# EAGLE board eTapper1main34 (EAGLE 8.3.2)
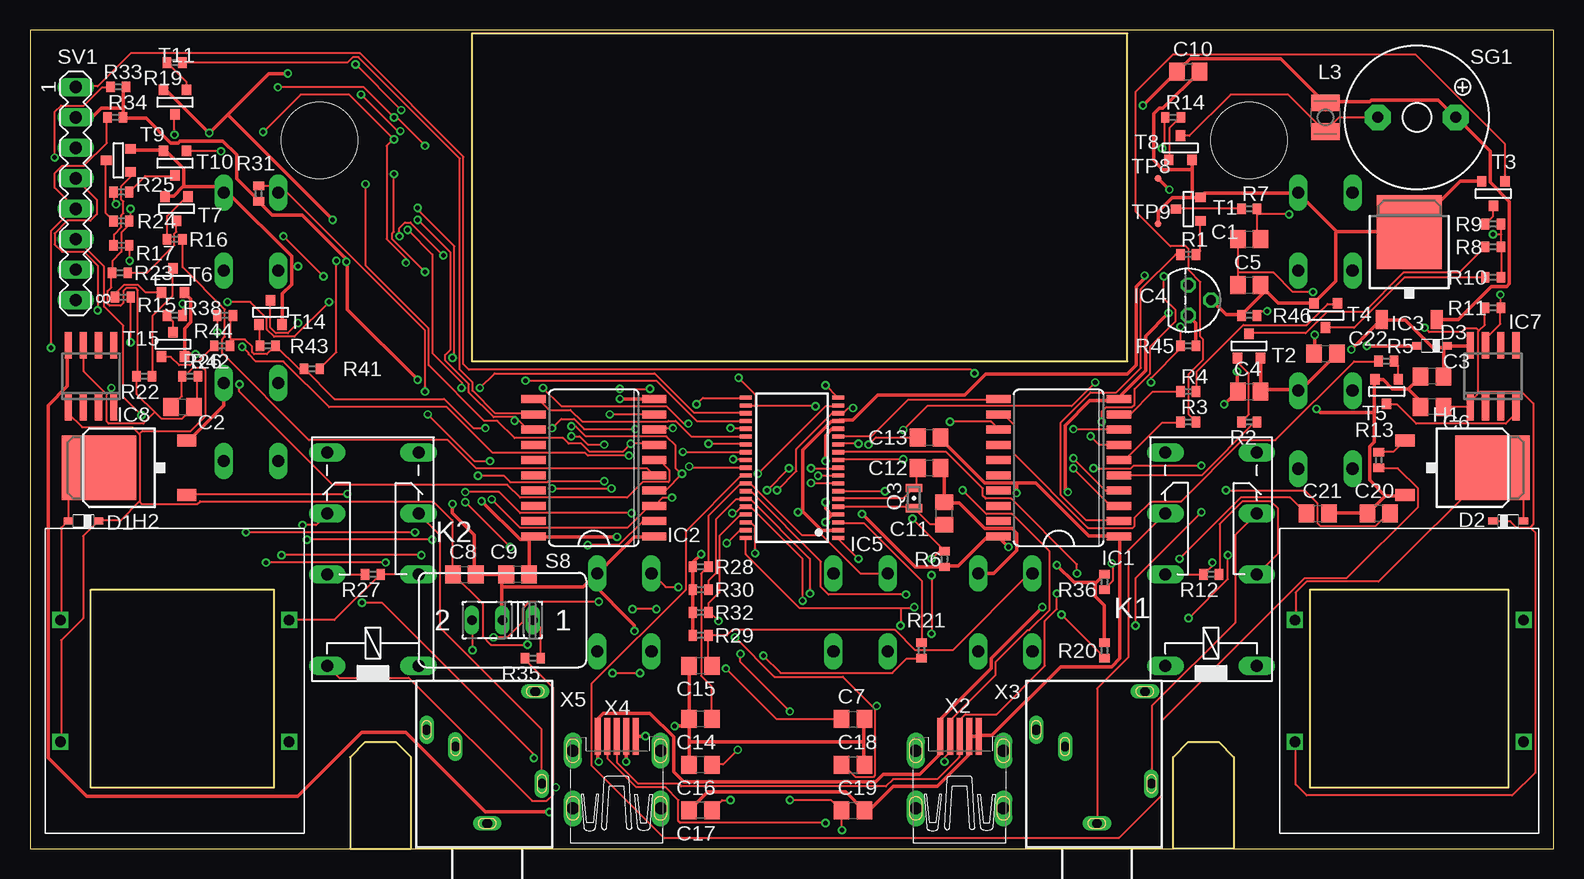
[diagram p1: board, top side]
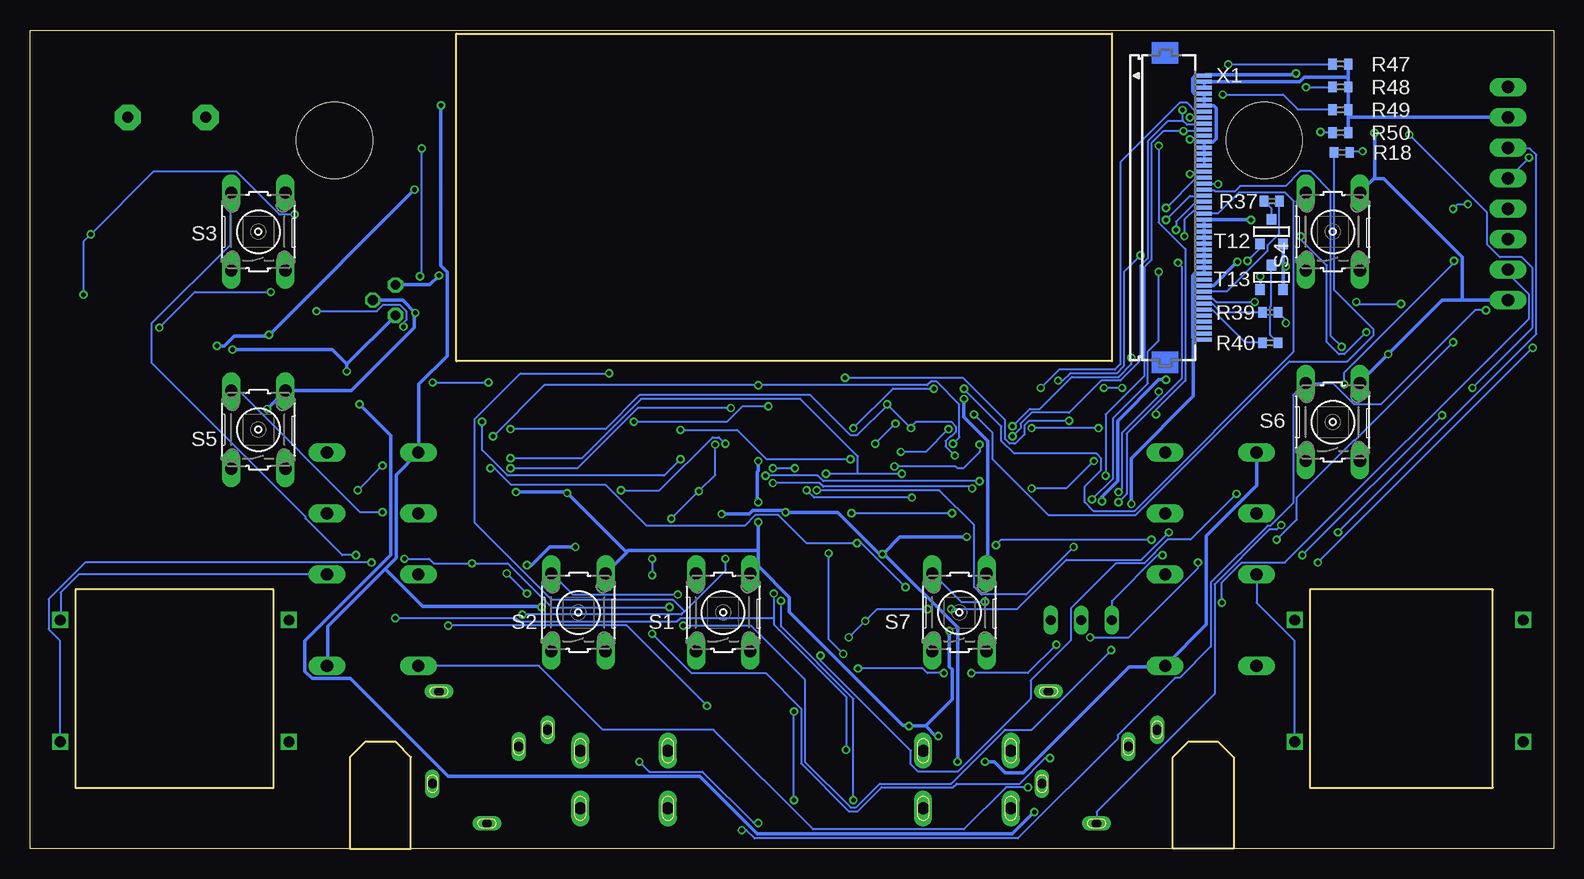
[diagram p2: board, bottom side, seen from below]

Size 126.98 x 68.25 mm. Coordinates in mm from the lower left corner, seen from the top.
Outline: 26.67,0 0,0 0,68.25 126.98,68.25 126.98,0 100.33,0
Outline: 31.75,0 95.25,0
Outline: 26.67,0 26.67,7.62 27.94,8.89 30.48,8.89 31.75,7.62 31.75,0
Outline: 26.67,0 31.75,0
Outline: 95.25,0 95.25,7.62 96.52,8.89 99.06,8.89 100.33,7.62 100.33,0
Outline: 100.33,0 95.25,0
Outline: 106.68,21.59 123.19,21.59 123.19,5.08 106.68,5.08 106.68,21.59
Outline: 5.08,21.59 20.32,21.59 20.32,5.08 5.08,5.08 5.08,21.59
Outline: 36.83,67.94 36.83,40.64 91.44,40.64 91.44,67.94 36.83,67.94
Copper layers (1*16): Top 0.035mm / dielectric 1.5mm / Bottom 0.035mm
Design rules "default *": minimum track width 6mil, minimum drill 15mil, track to track 6mil, track to pad 6mil, pad to pad 6mil, via to via 6mil, smd to smd 6mil, copper to edge 20mil, drill to drill 6mil, minimum pad ring 6mil, minimum via ring 6mil, stop-mask expansion 4mil, vias tented up to drill 0mil, thermal gap 10mil
Net classes: 1 GND: width 0.305 mm, clearance 0.152 mm; 2 BAT+: width 0.305 mm, clearance 0.152 mm; 3 +9V: width 0.305 mm, clearance 0.152 mm; 4 +3V: width 0.305 mm, clearance 0.152 mm; 5 VCC: width 0.305 mm, clearance 0.152 mm
Holes 6.35 mm at 24.13,59.05 101.6,59.05

## Footprints (pad centres in the part's own frame; a part is rotated, then mirrored left to right if it is on the bottom)
C0805 = smd 1.3 x 1.5: 1 -0.95,0; 2 0.95,0
SOD323_ST = smd 0.8 x 0.6: A 1.25,0; C -1.25,0
XFMR = drill 0.889 square: P$1 -10.16,5.08; P$2 -10.16,-5.08; P$3 8.89,5.08; P$4 8.89,-5.08
D-PAK_TO252AA = smd 1 x 1.6: 1 -2.28,-4.8; 3 2.28,-4.8 | smd 5.4 x 6.2: 4 0,2.5
SO20W = smd 0.66 x 2.032: 1 -5.715,-5.029; 2 -4.445,-5.029; 3 -3.175,-5.029; 4 -1.905,-5.029; 5 -0.635,-5.029; 6 0.635,-5.029; 7 1.905,-5.029; 8 3.175,-5.029; 9 4.445,-5.029; 10 5.715,-5.029; 11 5.715,5.029; 12 4.445,5.029; 13 3.175,5.029; 14 1.905,5.029; 15 0.635,5.029; 16 -0.635,5.029; 17 -1.905,5.029; 18 -3.175,5.029; 19 -4.445,5.029; 20 -5.715,5.029
TO252 = smd 1 x 1.6: 1 -2.28,-4.8; 3 2.28,-4.8 | smd 5.4 x 6.2: 2 0,2.5
TO92 = drill 0.813 pad 1.27 octagon: 1 -1.27,0; 2 0,1.905; 3 1.27,0
TSSOP38_R-PDSO-G38-DA = smd 0.35 x 1: 1 -5.85,-3.85; 2 -5.2,-3.85; 3 -4.55,-3.85; 4 -3.9,-3.85; 5 -3.25,-3.85; 6 -2.6,-3.85; 7 -1.95,-3.85; 8 -1.3,-3.85; 9 -0.65,-3.85; 10 0,-3.85; 11 0.65,-3.85; 12 1.3,-3.85; 13 1.95,-3.85; 14 2.6,-3.85; 15 3.25,-3.85; 16 3.9,-3.85; 17 4.55,-3.85; 18 5.2,-3.85; 19 5.85,-3.85; 20 5.85,3.85; 21 5.2,3.85; 22 4.55,3.85; 23 3.9,3.85; 24 3.25,3.85; 25 2.6,3.85; 26 1.95,3.85; 27 1.3,3.85; 28 0.65,3.85; 29 0,3.85; 30 -0.65,3.85; 31 -1.3,3.85; 32 -1.95,3.85; 33 -2.6,3.85; 34 -3.25,3.85; 35 -3.9,3.85; 36 -4.55,3.85; 37 -5.2,3.85; 38 -5.85,3.85
SO08 = smd 0.6 x 2.2: 1 -1.905,-2.6; 2 -0.635,-2.6; 3 0.635,-2.6; 4 1.905,-2.6; 5 1.905,2.6; 6 0.635,2.6; 7 -0.635,2.6; 8 -1.905,2.6
351 = drill 1.016 long: 1 -3.81,-3.81; 16 -3.81,3.81; O1 8.89,-3.81; O2 8.89,3.81; P1 3.81,-3.81; P2 3.81,3.81; S1 13.97,-3.81; S2 13.97,3.81
L2825P = smd 1.4 x 2.4: 1 -1.2,0; 2 1.2,0
FC-12M = smd 0.7 x 1.4: 1 -0.85,0; 2 0.85,0
R0402 = smd 0.7 x 0.9: 1 -0.65,0; 2 0.65,0
B3F-10XX = drill 1.016 long: 1 -3.251,2.261; 2 3.251,2.261; 3 -3.251,-2.261; 4 3.251,-2.261
M251 = drill 0.813 long: 1 -2.54,0; 2 0,0; 3 2.54,0
F/QMBIII = drill 0.914 pad 2.159 octagon: + 3.251,0; - -3.251,0
MA08-1 = drill 1.016 long: 1 -8.89,0; 2 -6.35,0; 3 -3.81,0; 4 -1.27,0; 5 1.27,0; 6 3.81,0; 7 6.35,0; 8 8.89,0
SOT-23 = smd 0.787 x 0.889: 1 0.025,-1.016; 2 -0.94,1.016; 3 0.991,1.016
TP06R = smd 0.6 x 0.6: TP 0,0
FH12-45S-0.5SH = smd 0.3 x 1.3: 1 -13,3.25; 2 -12.5,3.25; 3 -12,3.25; 4 -11.5,3.25; 5 -11,3.25; 6 -10.5,3.25; 7 -10,3.25; 8 -9.5,3.25; 9 -9,3.25; 10 -8.5,3.25; 11 -8,3.25; 12 -7.5,3.25; 13 -7,3.25; 14 -6.5,3.25; 15 -6,3.25; 16 -5.5,3.25; 17 -5,3.25; 18 -4.5,3.25; 19 -4,3.25; 20 -3.5,3.25; 21 -3,3.25; 22 -2.5,3.25; 23 -2,3.25; 24 -1.5,3.25; 25 -1,3.25; 26 -0.5,3.25; 27 0,3.25; 28 0.5,3.25; 29 1,3.25; 30 1.5,3.25; 31 2,3.25; 32 2.5,3.25; 33 3,3.25; 34 3.5,3.25; 35 4,3.25; 36 4.5,3.25; 37 5,3.25; 38 5.5,3.25; 39 6,3.25; 40 6.5,3.25; 41 7,3.25; 42 7.5,3.25; 43 8,3.25; 44 8.5,3.25; 45 9,3.25
32005-501 = smd 3.1 x 0.5: 1 3,1.6; 2 3,0.8; 3 3,0; 4 3,-0.8; 5 3,-1.6 | drill 1 pad 1.422 long: M1 -3,3.65; M2 -3,-3.65; M3 1.8,3.65; M4 1.8,-3.65
1503_09 = drill 0.8 pad 1.2 long: 1 0,-2.1; 2 -4.55,-5.4; 3 5.05,-9.9; 4 -4,-13.1; 5 2.65,-8.5

## Placement (x,y rotation side)
C1  .01uF  [C0805]  101.6,50.8 0 top
C2  .01uF  [C0805]  12.7,36.83 0 top
C3  [C0805]  116.84,39.37 180 top
C4  [C0805]  101.6,38.1 0 top
C5  3.3uF  [C0805]  101.6,46.99 0 top
C6  220uF  [C0805]  116.84,36.83 180 top
C7  220uF  [C0805]  68.58,10.79 0 top
C8  3.3uF  [C0805]  36.2,22.86 0 top
C9  47uF  [C0805]  40.64,22.86 180 top
C10  47uF  [C0805]  96.52,64.77 0 top
C11  12pF  [C0805]  76.2,27.94 90 top
C12  12pF  [C0805]  74.93,31.75 0 top
C13  1 uF  [C0805]  74.93,34.29 0 top
C14  .1uF  [C0805]  55.88,10.79 180 top
C15  .1uF  [C0805]  55.88,15.24 180 top
C16  .1uF  [C0805]  55.88,6.99 180 top
C17  .1uF  [C0805]  55.88,3.17 180 top
C18  .1uF  [C0805]  68.58,6.99 0 top
C19  .1uF  [C0805]  68.58,3.17 0 top
C20  .1uF  [C0805]  112.39,27.94 180 top
C21  .1uF  [C0805]  107.31,27.94 0 top
C22  220uF  [C0805]  107.95,41.27 0 top
D1  BAT60J  [SOD323_ST]  4.45,27.3 180 top
D2  BAT60J  [SOD323_ST]  123.19,27.3 0 top
D3  BAT60J  [SOD323_ST]  116.84,41.91 180 top
F1  XFMR  [XFMR]  115.57,13.97 0 top
F2  XFMR  [XFMR]  12.7,13.97 0 top
H1  IRLR024N  [D-PAK_TO252AA]  119.38,31.75 270 top
H2  IRLR024N  [D-PAK_TO252AA]  8.26,31.75 90 top
IC1  74AC373DW  [SO20W]  85.72,31.75 90 top
IC2  74AC373DW  [SO20W]  46.99,31.75 90 top
IC3  LM2936DT-5.0  [TO252]  114.94,48.9 0 top
IC4  LM2936Z-3.0  [TO92]  96.52,45.72 270 top
IC5  MSP430F2232IDA  [TSSOP38_R-PDSO-G38-DA]  63.5,31.75 90 top
IC7  LP2951M  [SO08]  121.92,39.37 0 top
IC8  LP2951M  [SO08]  5.08,39.37 0 top
K1  351  [351]  98.42,19.05 90 top
K2  351  [351]  28.57,19.05 90 top
L3  470uH  [L2825P]  107.95,60.96 270 top
Q3  FC-12M  [FC-12M]  73.66,29.21 90 top
R1  47K  [R0402]  96.52,49.53 0 top
R2  47K  [R0402]  101.6,35.56 180 top
R3  47K  [R0402]  96.52,35.56 0 top
R4  47K  [R0402]  96.52,38.1 0 top
R5  47K  [R0402]  113.03,40.64 0 top
R6  47K  [R0402]  76.2,24.13 270 top
R7  1K  [R0402]  101.6,53.34 0 top
R8  3K  [R0402]  121.92,50.16 0 top
R9  6K  [R0402]  121.92,52.07 0 top
R10  12K  [R0402]  121.92,47.62 0 top
R11  3K  [R0402]  121.92,45.09 0 top
R12  51K  [R0402]  98.42,22.86 180 top
R13  1K  [R0402]  112.39,32.38 90 top
R14  1K  [R0402]  95.25,60.96 0 top
R15  47K  [R0402]  7.75,45.97 180 top
R16  47K  [R0402]  12.06,50.8 180 top
R17  47K  [R0402]  7.62,50.29 180 top
R18  47K  [R0402]  17.65,58.04 0 bottom
R19  47K  [R0402]  12.06,65.53 180 top
R20  47K  [R0402]  89.53,16.51 90 top
R21  1K  [R0402]  74.3,16.51 270 top
R22  1K  [R0402]  9.53,39.37 180 top
R23  3K  [R0402]  7.49,48.01 180 top
R24  6K  [R0402]  7.62,52.32 0 top
R25  12K  [R0402]  7.62,54.74 180 top
R26  3K  [R0402]  13.34,39.37 0 top
R27  51K  [R0402]  28.57,22.86 180 top
R28  47K  [R0402]  55.88,23.5 180 top
R29  47K  [R0402]  55.88,17.78 180 top
R30  47K  [R0402]  55.88,21.59 180 top
R31  47K  [R0402]  19.05,54.61 270 top
R32  47K  [R0402]  55.88,19.68 180 top
R33  47K  [R0402]  7.37,63.5 0 top
R34  47K  [R0402]  7.11,60.96 0 top
R35  100  [R0402]  41.91,15.88 180 top
R36  47K  [R0402]  89.53,22.23 90 top
R37  100  [R0402]  23.5,53.98 0 bottom
R38  100  [R0402]  12.06,44.45 0 top
R39  100  [R0402]  23.62,44.7 180 bottom
R40  100  [R0402]  23.62,42.16 180 bottom
R41  47K  [R0402]  23.5,40.01 0 top
R42  47K  [R0402]  16,41.91 180 top
R43  47K  [R0402]  19.81,41.91 180 top
R44  47K  [R0402]  16.26,44.45 180 top
R45  47K  [R0402]  96.52,41.91 0 top
R46  10K  [R0402]  101.6,44.45 0 top
R47  47K  [R0402]  17.78,65.41 0 bottom
R48  47K  [R0402]  17.78,63.5 0 bottom
R49  47K  [R0402]  17.78,61.59 0 bottom
R50  47K  [R0402]  17.78,59.69 0 bottom
S1  [B3F-10XX]  69.22,19.68 90 bottom
S2  [B3F-10XX]  81.28,19.68 90 bottom
S3  [B3F-10XX]  107.95,51.44 90 bottom
S4  [B3F-10XX]  18.41,51.44 90 bottom
S5  [B3F-10XX]  107.95,34.92 90 bottom
S6  [B3F-10XX]  18.41,35.56 90 bottom
S7  [B3F-10XX]  49.53,19.68 90 bottom
S8  [M251]  39.37,19.05 180 top
SG1  F/QMBIII  [F/QMBIII]  115.57,60.96 0 top
SV1  100mil  [MA08-1]  3.81,54.61 270 top
T1  2N3904  [SOT-23]  96.52,53.34 270 top
T2  2N3904  [SOT-23]  101.6,41.91 180 top
T3  2N3904  [SOT-23]  121.92,54.61 0 top
T4  2N3904  [SOT-23]  107.95,44.45 0 top
T5  2N3904  [SOT-23]  113.03,38.1 0 top
T6  2N3904  [SOT-23]  11.94,47.37 180 top
T7  2N3904  [SOT-23]  12.19,53.34 0 top
T8  2N3904  [SOT-23]  95.89,58.42 180 top
T9  2N3904  [SOT-23]  7.37,57.4 270 top
T10  2N3904  [SOT-23]  12.06,57.15 0 top
T11  2N3904  [SOT-23]  12.06,62.23 0 top
T12  2N3904  [SOT-23]  23.5,51.44 180 bottom
T13  2N3904  [SOT-23]  23.5,47.62 180 bottom
T14  2N3904  [SOT-23]  20.07,44.7 180 top
T15  2N3904  [SOT-23]  11.94,42.04 180 top
TP8  TPSTP06R  [TP06R]  93.98,55.88 0 top
TP9  TPSTP06R  [TP06R]  93.98,52.07 0 top
X1  FH12-45S-0.5SH  [FH12-45S-0.5SH]  32.38,51.44 270 bottom
X2  MINI-USB_SHIELD5P4-32005-501  [32005-501]  77.47,6.35 90 top
X3  1503_09  [1503_09]  88.9,0 180 top
X4  MINI-USB_SHIELD5P4-32005-501  [32005-501]  48.9,6.35 90 top
X5  1503_09  [1503_09]  38.1,0 180 top

## Tracks (layer width: path | path; a pad name or v marks a point on that pad's centre or on a via)
+3V  (via drill 0.38)
  Top 0.305: 7.77,61.72 7.77,63.25 8,63.48 R33.2 | 7.77,61.72 7.77,60.96 R34.2 7.85,60.88 9.68,60.88 11.73,58.83 12.34,58.83 12.5,58.98 16.08,58.98 17.22,57.84 17.22,55.85 19.05,54.03 R31.2 19.13,53.87 20.19,52.81 22.71,52.81 26.36,49.15 v26.36,48.92 26.44,48.84 26.44,44.96 v32.31,39.09 | SV1.2 5.18,60.96 5.94,61.72 7.77,61.72 | R20.2 89.53,20.27 88.77,21.03 88.77,22.1 | 88.77,22.1 89.53,22.86 R36.2 | v85.57,23.62 87.02,22.17 88.7,22.17 88.77,22.1 | v81.53,25.15 80.77,25.91 IC1.20 80.7,25.98 79.78,25.98 77.34,23.55 76.2,23.55 R6.2 76.12,23.47 73.76,23.47 v69.34,27.89 | IC2.20 41.6,25.68 41.6,22.86 C9.1 | R29.2 55.24,17.83 55.24,19.66 R32.2 55.24,19.81 55.24,21.57 R30.2 55.24,21.72 55.24,23.47 R28.2 55.32,23.62 55.32,23.93 v55.93,24.54 | 64.39,28.12 65.99,26.52 67.28,26.52 IC5.2 | 64.39,28.12 64.39,33.22 66.75,35.59 67.28,35.59 IC5.16 67.44,35.74 68.58,35.74 70.64,37.8 77.88,37.8 79.63,39.55 91.44,39.55 92.2,40.31 92.2,46.86 92.89,47.55 v92.89,47.78 | v64.01,28.04 64.31,28.04 64.39,28.12 | v48.92,25.98 42.06,25.98 IC2.20 | v49.68,7.24 49.68,9.3 X4.4 | v37.64,28.96 40.84,25.76 41.53,25.76 IC2.20
  Bottom 0.305: X1.3 29.11,63.48 29.11,63.93 X1.2 28.96,63.93 21.18,63.93 20.8,64.31 17.14,64.31 | 17.14,60.96 17.14,61.57 R49.2 17.14,61.72 17.14,63.48 R48.2 17.14,63.63 17.14,64.31 | 17.14,60.96 17.14,59.74 R50.2 | 17.14,64.31 17.14,65.38 R47.2 | v26.36,48.92 28.35,46.94 29.11,46.94 X1.36 | SV1.2 17.14,60.96 | v85.57,23.62 85.19,23.62 83.67,25.15 v81.53,25.15 | v92.89,47.78 93.65,47.02 96.47,47.02 IC4.1 | v55.93,24.54 56.16,24.54 59.66,28.04 v64.01,28.04 64.16,28.19 66.75,28.19 67.06,27.89 v69.34,27.89 | v48.92,25.98 54.48,25.98 v55.93,24.54 | v49.68,7.24 49.68,18.44 55.78,24.54 v55.93,24.54 | v32.31,39.09 32.92,39.09 36.35,35.66 36.35,30.63 37.64,29.34 v37.64,28.96
+9V  (via drill 0.38)
  Top 0.305: D3.C 120.02,41.91 IC7.8 | C3.1 117.81,39.4 117.81,41.68 117.96,41.83 D3.C | D3.C 117.73,41.76 116.89,41.76 114.61,44.04 112.7,44.04 IC3.1 112.55,44.04 v110.11,41.6 | IC4.3 97.16,43.81 97.16,41.91 R45.2 | v100.58,39.78 100.58,38.1 C4.1 100.51,38.02 v99.52,37.03 | v43.28,3.05 37.95,3.05 31.32,9.68 27.66,9.68 22.33,4.34 4.72,4.34 1.52,7.54 1.52,36.96 3.12,38.56 3.12,41.91 IC8.8
  Bottom 0.305: 100.58,40.39 v100.58,39.78 | IC4.3 100.58,40.39 | v43.28,3.05 45.11,1.22 66.37,1.22 71.17,6.02 92.13,6.02 100.28,14.17 103.48,14.17 104.09,14.78 104.09,17.3 96.93,24.46 96.93,34.44 v99.52,37.03 | v110.11,41.6 101.8,41.6 100.58,40.39
/LCS  (via drill 0.38)
  Top 0.152: v20.65,63.48 27.81,63.48 v30.33,60.96 30.56,60.96 v32.92,58.6 | v65.08,30.48 67.28,30.48 IC5.8 | v43.51,30.02 v48.46,30.02 | v38.33,32.31 37.03,32.31 v33.15,36.2
  Bottom 0.152: v20.65,63.48 18.44,63.48 R48.1 | v30.33,60.96 29.18,60.96 X1.8 | v65.08,30.48 61.19,30.48 60.88,30.18 48.62,30.18 v48.46,30.02 | v43.51,30.02 40.62,30.02 v38.33,32.31 | v33.15,36.2 33.15,36.58 30.71,39.01 30.71,49.99 32.92,52.2 v32.92,58.6
/RST  (via drill 0.38)
  Top 0.152: v73.53,27.51 76.2,24.84 R6.1 75.97,24.99 v75.13,24.16 | v71.25,29.79 67.36,29.79 IC5.7 | C13.1 70.48,34.29 v69.88,33.68 | v27.66,20.5 29.34,20.5 41.99,7.85 v41.99,7.54 | v75.13,22.78 v75.13,17.91
  Bottom 0.152: v73.53,27.51 v71.25,29.79 69.88,31.17 v69.88,33.68 | SV1.7 3.81,47.93 2.06,46.18 2.06,44.2 22.4,23.85 25.98,23.85 27.66,22.17 v27.66,20.5 | v41.99,7.54 42.37,7.54 44.5,5.41 49.76,5.41 50.06,5.11 56.01,5.11 57.99,3.12 58.75,3.12 62.71,7.09 62.71,11.66 65.68,14.63 71.86,14.63 v75.13,17.91 | v75.13,24.16 v75.13,22.78
BAT+  (via drill 0.38)
  Top 0.305: v94.94,54.94 94.03,55.85 TP8.TP | v107.06,42.82 107.06,41.3 C22.1 | v111.4,41.91 D3.A
  Bottom 0.305: v94.94,54.94 v107.06,42.82 107.14,42.75 109.96,42.75 110.8,41.91 v111.4,41.91
GND  (via drill 0.38)
  Top 0.305: T3.2 119.18,55.63 114.99,51.44 IC3.2 114.83,51.44 108.89,51.44 | 96.85,54.25 97.54,54.25 T1.2 97.61,54.41 97.84,54.63 105.69,54.63 S3.4 105.77,54.56 108.89,51.44 | 96.85,54.25 95.17,54.25 94.03,53.11 94.03,52.12 TP9.TP | 96.85,54.25 96.85,56.62 | 96.85,56.62 96.85,57.38 T8.2 | 96.85,56.62 94.41,56.62 93.65,57.38 93.65,61.27 94.11,61.72 94.41,61.72 C10.2 | 114.83,38.33 113.54,38.33 112.78,39.09 112.09,39.09 T5.2 112.01,39.01 112.01,36.35 | 114.83,38.33 115.82,39.32 C3.2 | 114.83,38.33 115.82,37.34 115.82,36.88 C6.2 | C21.2 108.28,27.96 111.4,27.96 C20.2 111.56,28.04 112.93,29.41 | 112.93,29.41 114.53,29.41 H1.3 | 112.01,36.35 112.01,33.91 111.63,33.53 111.63,30.71 112.93,29.41 | T2.2 102.56,40.84 102.56,38.1 C4.2 102.64,38.25 105.61,38.25 S5.4 105.84,38.18 108.89,41.22 C22.2 | v94.87,44.65 92.96,42.75 92.96,39.85 90.75,37.64 IC1.10 90.68,37.34 88.32,37.34 86.26,35.28 86.26,29.95 v86.49,29.72 | IC4.2 98.45,45.72 99.67,44.5 100.81,44.5 R46.1 100.97,44.5 102.95,46.48 C5.2 102.56,46.94 104.01,45.49 106.98,45.49 T4.2 107.06,45.57 108.81,47.32 108.81,51.36 108.89,51.44 | 112.01,36.35 107.52,36.35 v107.21,36.65 | T6.2 12.88,46.33 13.41,45.8 13.41,43.89 12.88,43.36 T15.2 12.95,41.22 v13.79,41.22 | S6.4 16.15,36.96 13.26,34.06 13.11,34.06 H2.3 | T9.2 8.38,58.29 8.46,58.22 11.12,58.22 T10.2 11.2,58.06 11.43,58.06 12.8,56.69 12.8,55.24 12.72,55.17 | 21.79,48.54 21.79,49.38 16.54,54.63 16.15,54.63 S4.4 16.08,54.79 15.7,55.17 12.72,55.17 | 21.79,48.54 21.79,47.02 21.03,46.25 21.03,43.74 T14.2 | 12.72,55.17 11.96,54.41 11.28,54.41 T7.2 | T11.2 11.35,63.25 v14.94,59.66 16.46,61.19
  Top 0.305: 21.79,48.54 v22.33,48.54 | v21.49,64.62 19.89,64.62 16.46,61.19 | 16.46,61.19 v25.22,52.43 | 39.32,21.79 39.32,19.05 S8.2 | 39.32,21.79 39.32,22.78 C9.2 C8.2 37.03,22.94 37.03,26.14 35.2,27.96 v35.2,28.73 | IC2.1 51.97,25.98 50.37,25.98 47.32,22.94 S7.4 | v49.15,37.49 51.97,37.49 IC2.10 | 39.32,21.79 46.1,21.79 47.17,22.86 S7.4 | C17.2 54.94,3.2 56.46,4.72 67.97,4.72 69.49,3.2 C19.2 69.65,3.28 70.03,3.28 71.93,5.18 75.59,5.18 78.26,7.85 78.26,9.22 X2.4 78.33,9.37 79.02,9.37 X2.5 79.17,9.45 80.16,9.45 85.88,15.16 90.14,15.16 90.83,15.85 90.83,25.91 IC1.1 90.75,26.06 88.24,26.06 83.82,30.48 82.22,30.48 | 69.49,8.91 69.49,10.74 C7.2 | 69.49,8.91 69.49,7.01 C18.2 | 54.94,8.91 54.94,10.74 C14.2 | 54.94,8.91 54.94,7.01 C16.2 | C15.2 54.94,10.9 C14.2 | 54.94,8.91 69.49,8.91 | v51.28,9.37 50.52,9.37 X4.5 | v53.72,10.21 54.86,10.21 C14.2 | 82.22,30.48 79.55,30.48 75.89,34.14 75.89,34.29 C13.2 | 66.83,27.81 67.28,27.81 IC5.4 | 66.83,27.81 66.29,27.28 v66.29,27.2 | v66.29,32.31 66.29,34.44 66.83,34.98 67.28,34.98 IC5.15 | v66.29,28.88 66.29,28.35 66.83,27.81 | C12.2 75.89,31.7 76.2,31.39 C11.2 76.28,28.8 77.42,28.8 79.55,26.67 81.84,26.67 82.22,26.29 82.22,24.84 80.31,22.94 S2.4 | v82.22,29.64 82.22,30.48 | v50.37,18.14 50.37,18.59 46.71,22.25 S7.4
  Bottom 0.305: IC4.2 95.94,45.72 v94.87,44.65 94.94,44.58 94.94,43.43 100.2,38.18 S5.4 v107.21,36.65 | S6.4 16.15,38.86 v13.79,41.22 9.3,45.72 7.62,45.72 | 7.62,45.72 SV1.8 | 29.95,42.44 29.18,42.44 X1.45 | 29.95,42.44 30.1,42.6 30.1,47.78 29.95,47.93 29.18,47.93 X1.34 29.11,48.08 29.11,48.39 X1.33 29.11,48.54 29.11,48.92 X1.32 29.11,49.07 29.11,49.38 X1.31 29.11,49.53 29.11,49.91 X1.30 29.11,50.06 29.11,50.37 X1.29 29.11,50.52 29.11,50.9 X1.28 29.11,51.05 29.11,51.44 X1.27 29.11,51.51 29.11,51.89 X1.26 29.11,52.05 29.11,52.43 X1.25 28.96,52.43 v25.22,52.43 | X1.16 29.11,57 29.11,57.38 X1.15 29.11,57.53 29.11,57.91 X1.14 29.11,58.06 29.11,58.37 X1.13 29.11,58.52 29.11,58.9 X1.12 28.96,58.9 28.42,58.9 28.12,59.21 28.12,61.72 28.35,61.95 28.96,61.95 X1.6 29.11,61.95 29.11,62.41 X1.5 29.11,62.56 29.11,62.87 X1.4 29.26,62.94 29.95,62.94 30.1,63.09 30.1,64.24 29.87,64.47 29.18,64.47 X1.1 29.03,64.54 21.57,64.54 v21.49,64.62 | T12.2 22.55,48.54 | 22.55,48.54 T13.2 | 14.94,55.93 v14.94,59.66 | 14.94,55.93 16.15,54.71 S4.4 | v22.33,48.54 22.55,48.54 | 7.62,45.72 7.62,49.3 14.17,55.85 14.86,55.85 14.94,55.93 | v49.15,37.49 49.15,35.97 47.17,33.98 47.17,23.01 47.24,22.94 S7.4 | v51.28,9.37 51.51,9.37 52.35,10.21 | 52.35,10.21 v53.72,10.21 53.8,10.29 54.25,10.29 63.7,19.74 63.7,20.95 66.22,23.47 S1.4 66.9,22.94 66.29,23.55 66.29,24.84 | 66.29,24.84 v66.29,27.2 | v66.29,32.31 66.29,31.47 66.37,31.39 66.37,28.96 v66.29,28.88 | 66.29,24.84 77.11,24.84 77.27,24.69 | S2.4 77.27,24.69 | 77.27,24.69 v82.22,29.64 82.3,29.72 v86.49,29.72 | v50.37,18.14 50.37,15.16 50.14,14.94 50.14,12.42 52.35,10.21
  Bottom 0.305: v35.2,28.73 35.2,32.54 30.02,37.72 30.02,42.37 29.95,42.44
IO1_0
  Top 0.152: C14.1 56.77,10.82 56.77,13.56 55.93,14.4 55.93,22.94 56.46,23.47 R28.1 56.54,23.55 56.54,27.74 59.21,30.4 59.59,30.4 IC5.31 59.66,30.4 60.05,30.4 64.31,26.14 65.99,26.14 69.19,22.94 S1.2
IO1_1  (via drill 0.38)
  Top 0.152: C15.1 56.77,15.24 56.54,15.47 56.54,17.75 R29.1 56.62,17.75 58.06,17.75 58.52,18.21 72.08,18.21 73.76,16.54 76.89,16.54 83.29,22.94 S2.2 | v73,21.18 66.52,21.18 65.91,21.79 65.91,23.93 60.05,29.79 59.66,29.79 IC5.32
  Bottom 0.152: v73,21.18 81.76,21.18 83.52,22.94 S2.2
IO1_2  (via drill 0.38)
  Top 0.152: R30.1 56.54,21.64 56.54,22.33 57.15,22.94 57.15,27.43 58.83,29.11 59.59,29.11 IC5.33 59.66,29.11 60.05,29.11 65,24.16 v65,21.26 | v58.98,8.23 57.76,7.01 56.84,7.01 C16.1 | v99.82,24.46 99.82,22.48 v96.55,19.2
  Bottom 0.152: v58.98,8.23 58.98,12.65 65,18.67 65,19.2 | v65,21.26 65,19.2 | v99.82,24.46 100.97,24.46 104.01,27.51 104.01,27.66 116.81,40.46 116.81,43.81 110.26,50.37 110.26,54.63 S3.2 | v96.55,19.2 86.49,19.2 86.18,18.9 73.08,18.9 72.77,19.2 65,19.2
IO1_3  (via drill 0.38)
  Top 0.152: R31.1 19.05,55.24 20.12,55.24 S4.2 20.73,54.63 21.49,54.63 32.92,43.2 v32.92,38.1 | v64.39,20.65 64.39,24.16 60.05,28.5 59.66,28.5 IC5.34 59.59,28.5 59.28,28.5 58.75,27.96 v58.52,27.96 | v58.37,4.04 57.68,4.04 56.84,3.2 C17.1 | v36.27,29.72 39.09,29.72 40.84,27.96 v50.14,27.96
  Bottom 0.152: v64.39,20.65 64.39,18.52 58.37,12.5 v58.37,4.04 | v32.92,38.1 32.92,37.72 35.97,34.67 35.97,30.02 v36.27,29.72 | v58.52,27.96 v50.14,27.96
IO4_0  (via drill 0.38)
  Top 0.152: v62.26,29.87 63.86,31.47 63.86,33.3 66.83,36.27 67.28,36.27 IC5.17 67.36,36.35 67.82,36.35 68.2,36.73 v68.58,36.73 | v53.49,29.26 52.73,29.26 52.05,28.57 IC2.3 51.59,28.57 49.76,26.75 40.84,26.75 v38.48,29.11 | v30.33,56.24 30.33,51.44 30.18,51.28 30.18,50.83 v32.92,48.08 | IC1.3 90.07,28.57 v86.94,31.7
  Bottom 0.152: v62.26,29.87 61.65,29.26 v53.49,29.26 | v30.33,56.24 30.18,56.39 29.18,56.39 X1.17 | v32.92,48.08 32.92,42.37 33.83,41.45 33.83,38.79 36.73,35.89 36.73,30.86 v38.48,29.11 | v86.94,31.7 81.38,31.7 76.35,36.73 v68.58,36.73
IO4_1  (via drill 0.38)
  Top 0.152: v60.66,31.24 66.29,36.88 67.28,36.88 IC5.18 | IC2.4 52.05,29.87 52.96,29.87 v54.33,31.24 54.25,31.24 53.8,31.7 53.8,33.6 53.03,34.37 46.33,34.37 45.49,35.2 v45.11,35.2 | v32.31,53.42 32.31,53.26 35.36,50.22 35.36,41.07 v35.2,40.92 | v86.94,32.54 89.61,29.87 90.75,29.87 IC1.4
  Bottom 0.152: v54.33,31.24 57.99,31.24 | 57.99,31.24 v60.66,31.24 | v32.31,53.42 29.79,55.93 29.18,55.93 X1.18 | v35.2,40.92 35.2,40.39 36.27,39.32 40.16,39.32 42.82,36.65 43.66,36.65 v45.11,35.2 | v86.94,32.54 81,32.54 76.05,37.49 62.79,37.49 57.99,32.69 57.99,31.24
IO4_2  (via drill 0.38)
  Top 0.152: v66.29,38.63 67.28,37.64 IC5.19 | IC2.7 51.97,33.68 51.89,33.76 v50.06,33.76 49.38,33.07 46.63,33.07 45.95,33.76 44.88,33.76 44.42,34.21 40.39,34.21 38.94,35.66 37.87,35.66 33.22,40.31 33.22,43.36 27.96,48.62 v27.96,55.4 | v88.39,34.37 89.08,33.68 90.75,33.68 IC1.7
  Bottom 0.152: v50.06,33.76 49.53,34.29 49.53,37.03 51.44,38.94 51.89,38.94 52.2,38.63 v66.29,38.63 84.12,38.63 v88.39,34.37 | v27.96,55.4 29.11,55.4 X1.19
IO4_3  (via drill 0.38)
  Top 0.152: v55.55,37.03 56.08,37.57 59.59,37.57 IC5.20 | v53.57,35.05 52.12,35.05 52.05,34.98 IC2.8 | v17.68,41.83 18.21,41.3 18.21,41.22 18.82,40.62 21.11,40.62 24.92,36.8 34.75,36.8 38.56,32.99 46.25,32.99 46.48,32.77 v49.91,32.77 | v86.94,34.98 90.75,34.98 IC1.8
  Bottom 0.152: v17.68,41.83 18.59,42.75 18.59,54.79 20.27,56.46 21.11,56.46 22.33,55.24 26.14,55.24 26.59,54.79 28.19,54.79 28.27,54.86 29.11,54.86 X1.20 | v49.91,32.77 50.67,33.53 50.67,33.98 50.29,34.37 50.22,34.37 49.84,34.75 49.84,35.2 50.22,35.59 53.11,35.59 53.57,35.13 v53.57,35.05 v55.55,37.03 55.55,36.96 58.06,34.44 58.6,34.44 61.95,37.8 76.2,37.8 79.02,34.98 v86.94,34.98
IO4_4  (via drill 0.38)
  Top 0.152: v65.46,36.88 60.43,36.88 | 60.43,36.88 59.66,36.88 IC5.21 | v76.66,35.59 80.09,35.59 80.7,34.98 IC1.13 | v32.31,52.43 35.05,49.68 35.05,41.6 34.59,41.15 34.59,40.69 36.58,38.71 36.58,38.02 38.63,35.97 40.46,35.97 40.58,35.85 | 40.58,35.85 41.45,34.98 41.91,34.98 IC2.13 | 60.43,36.88 60.43,37.87 v59.05,39.24 | 40.58,35.85 v40.39,35.66
  Bottom 0.152: v65.46,36.88 67.59,36.88 68.89,35.59 v76.66,35.59 | v32.31,52.43 30.33,54.41 29.18,54.41 X1.21 | v59.05,39.24 49.23,39.24 45.72,35.74 45.72,34.14 45.34,33.76 44.88,33.76 44.12,34.52 44.12,35.28 43.74,35.66 v40.39,35.66
IO4_5  (via drill 0.38)
  Top 0.152: v37.49,38.41 38.71,39.62 52.05,39.62 55.32,36.35 59.59,36.35 IC5.22 | v35.97,38.41 35.97,38.86 33.53,41.3 33.53,49.53 v31.47,51.59
  Bottom 0.152: v35.97,38.41 v37.49,38.41 | v31.47,51.59 31.47,52.27 29.87,53.87 29.18,53.87 X1.22
IO4_6  (via drill 0.38)
  Top 0.152: v41.3,39.01 52.2,39.01 55.55,35.66 59.59,35.66 IC5.23 | v34.44,49.45 31.7,52.2 31.24,52.2 30.79,51.74 v30.79,51.05
  Bottom 0.152: v41.3,39.01 40.92,39.01 40.31,39.62 36.42,39.62 35.81,40.23 35.81,48.08 v34.44,49.45 | v30.79,51.05 30.79,52.43 29.79,53.42 29.18,53.42 X1.23
IO4_7  (via drill 0.38)
  Top 0.152: v58.37,35.05 59.59,35.05 IC5.24 | v49.15,38.33 v51.66,38.33
  Bottom 0.152: v58.37,35.05 55.09,38.33 v51.66,38.33 | v49.15,38.33 46.02,35.2 46.02,33.98 44.96,32.92 38.1,32.92 37.72,32.54 37.72,31.55 39.09,30.18 39.09,28.88 38.33,28.12 34.98,28.12 21.72,41.38 21.72,54.03 22.4,54.71 26.21,54.71 27.96,52.96 29.11,52.96 X1.24
J2_1
  Top 0.152: R12.1 99.14,22.86 99.14,27.05 101.04,28.96 103.4,28.96 104.01,28.35 104.01,24.61 102.26,22.86 K1.P1
  Bottom 0.152: K1.P1 122.91,22.86 124.44,21.34 124.44,19.05 F1.P$3
J2_3  (via drill 0.38)
  Top 0.152: K1.P2 R12.2 97.84,22.86 98.53,23.55 v98.53,23.85
  Bottom 0.152: v98.53,23.85 122.38,23.85 125.42,20.8 125.42,18.29 124.51,17.37 124.51,8.91 F1.P$4
J3_1
  Top 0.152: K2.P1 R27.1 29.18,22.86 25.38,19.05 F2.P$3
J3_3
  Top 0.152: K2.P2 R27.2
  Bottom 0.152: K2.P2 24.77,20.5 21.64,17.37 21.64,8.91 F2.P$4
LD_/C  (via drill 0.38)
  Top 0.152: v30.94,61.57 v27.13,65.38 | v54.94,31.85 55.02,31.77 59.59,31.77 IC5.29 | v47.85,33.68 46.48,33.68 45.8,34.37 v45.11,34.37
  Bottom 0.152: v27.13,65.38 18.44,65.38 R47.1 | v30.94,61.57 30.94,60.73 30.9,60.69 | 30.9,60.69 30.56,60.35 29.26,60.35 29.18,60.43 X1.9 | v54.94,31.85 49.84,31.85 49.68,31.7 49.23,31.7 47.85,33.07 v47.85,33.68 | v45.11,34.37 44.42,35.05 44.42,35.43 43.51,36.35 40.39,36.35 37.72,39.01 36.12,39.01 34.44,40.69 34.44,48.62 33.83,49.23 33.83,58.98 32.16,60.66 30.94,60.66 30.9,60.69
LEDK1
  Bottom 0.152: R37.2 22.86,53.95 22.86,51.28 23.85,50.29 23.85,49.84 27.2,46.48 29.11,46.48 X1.37
LEDK2  (via drill 0.38)
  Top 0.152: v12.72,45.41 12.72,44.5 R38.2 | v16.46,45.57 18.36,45.57 19.74,44.2 19.74,43.28 20.34,42.67 22.02,42.67 v24.92,45.57
  Bottom 0.152: v12.72,45.41 16.31,45.41 v16.46,45.57 | v24.92,45.57 28.12,45.57 28.42,45.87 29.11,45.87 X1.38
LEDK3
  Bottom 0.152: R39.2 24.31,44.73 27.74,44.73 28.42,45.41 29.11,45.41 X1.39
LEDK4
  Bottom 0.152: R40.2 24.31,42.22 25.76,42.22 28.42,44.88 29.11,44.88 X1.40
LHVTRIG
  Top 0.152: R13.1 112.39,31.7 114,31.7 115.67,30.02 115.67,28.5 109.73,22.55 106.22,22.55 94.34,10.67 94.34,4.5 90.75,0.91 52.81,0.91 46.79,6.93 46.79,13.72 54.63,21.57 54.63,26.44 59.28,31.09 59.59,31.09 IC5.30
LLED  (via drill 0.38)
  Top 0.152: 16.69,42.44 16.69,44.27 16.84,44.42 R44.1 | 16.69,42.44 16.69,41.91 R42.1 | v54.41,33.07 59.59,33.07 IC5.27 | v50.44,34.98 46.18,34.98 45.34,35.81 44.27,35.81 v43.51,35.05 | v37.95,35.05 36.96,35.05 34.52,37.49 25.38,37.49 R41.1 22.4,40.01 20.5,41.91 R43.1 20.42,41.91 19.74,41.22 18.67,41.22 18.52,41.38 18.52,41.83 17.91,42.44 16.69,42.44
  Bottom 0.152: v54.41,33.07 52.35,33.07 v50.44,34.98 | v37.95,35.05 v43.51,35.05
LRD  (via drill 0.38)
  Top 0.152: v19.43,59.74 22.55,62.87 26.59,62.87 v30.33,59.13 30.25,59.13 29.72,58.6 29.72,50.83 31.32,49.23 v31.32,48.84 | v65.08,31.7 67.28,31.7 IC5.10 | v61.42,29.87 v63.25,31.7 | v36.27,28.88 v40.01,25.15
  Bottom 0.152: v19.43,59.74 18.44,59.74 R50.1 | v30.33,59.13 30.1,59.13 29.87,59.36 29.18,59.36 X1.11 | v63.25,31.7 v65.08,31.7 | v61.42,29.87 51.21,29.87 48.31,26.98 48.31,21.79 47.7,21.18 43.97,21.18 v40.01,25.15 | v36.27,28.88 35.59,29.57 35.59,34.59 31.01,39.17 31.01,48.54 v31.32,48.84
LRESET  (via drill 0.38)
  Top 0.152: v56.54,33.76 59.59,33.76 IC5.26 | v54.86,35.43 54.48,35.43 53.03,36.88 44.27,36.88 v42.75,38.41
  Bottom 0.152: v54.86,35.43 v56.54,33.76 | v42.75,38.41 41.22,39.93 36.58,39.93 36.12,40.39 36.12,57.23 31.17,62.18 30.56,62.18 29.87,61.49 29.18,61.49 X1.7
LTS+
  Top 0.152: K1.O2 91.52,24.84 91.52,15.93 88.92,13.34 88.92,2.13 X3.1
LTS-
  Top 0.152: K1.O1 100.43,26.14 100.43,18.82 93.5,11.89 93.5,5.41 X3.2
LVSEL
  Top 0.152: IC5.14 67.36,34.37 70.1,34.37 73.15,37.41 80.7,37.41 IC1.11
LWR  (via drill 0.38)
  Top 0.152: v27.58,62.87 30.63,59.82 v30.86,59.82 | v65.68,31.09 67.28,31.09 IC5.9 | v47.85,30.63 43.2,30.63 43.13,30.56 40.01,30.56 39.47,31.09 v37.34,31.09
  Bottom 0.152: v27.58,62.87 22.55,62.87 21.34,61.65 18.44,61.65 R49.1 | X1.10 29.18,59.89 29.26,59.82 v30.86,59.82 32.54,59.82 33.53,58.83 33.53,49.07 34.14,48.46 34.14,39.4 37.34,36.2 v37.34,31.09 | v65.68,31.09 61.34,31.09 60.88,30.63 v47.85,30.63
N$1
  Top 0.152: R1.1 95.48,49.53 92.58,46.63 92.58,40.08 90.53,38.02 88.39,38.02 85.88,35.51 85.88,29.49 88.01,27.36 90.75,27.36 IC1.2
N$2
  Top 0.152: R2.1 102.18,35.51 102.03,35.51 97.69,31.17 90.75,31.17 IC1.5
N$3
  Top 0.152: IC1.6 91.21,32.38 94.34,35.51 95.86,35.51 R3.1
N$4
  Top 0.152: R4.1 93.57,38.1 91.67,36.2 IC1.9
N$5
  Top 0.152: IC1.12 81.15,36.2 81.99,35.36 81.99,32.92 88.16,26.75 91.9,26.75 92.05,26.9 92.05,27.58 93.42,28.96 95.94,28.96 101.04,34.06 103.78,34.06 110.34,40.62 112.32,40.62 R5.1
N$6
  Top 0.152: T8.1 96.62,59.44 100.05,62.87 104.85,62.87 107.9,59.82 L3.2 107.97,59.82 109.12,60.96 SG1.-
N$7
  Top 0.152: T4.3 108.89,45.41 108.13,45.41 106.38,43.66 101.12,43.66 97.23,39.78 97.23,38.1 R4.2
N$8
  Top 0.152: T5.3 114,39.17 114,40.31 113.69,40.62 R5.2
N$9
  Top 0.152: D2.A 124.44,27.36 124.44,29.18 121.92,31.7 H1.4 121.84,31.7 112.39,22.25 106.38,22.25 105.46,21.34 105.46,19.05 F1.P$1
N$10
  Top 0.152: R7.1 95.56,53.34 T1.1
N$11
  Top 0.152: T2.1 101.58,42.98 106.3,42.98 108.05,44.73 111.18,44.73 114.45,48.01 119.1,48.01 121.23,50.14 R8.1
N$12
  Top 0.152: T3.1 121.92,53.57 121.92,52.73 121.31,52.12 R9.1
N$13
  Top 0.152: T1.3 97.54,49.84 97.23,49.53 R1.2
N$14
  Top 0.152: T2.3 100.66,40.84 100.66,40.54 101.58,39.62 101.58,36.2 100.97,35.59 R2.2
N$15
  Top 0.152: T3.3 122.91,58.75 115.44,66.22 95.25,66.22 92.13,63.09 92.13,53.11 95.02,50.22 96.32,50.22 96.55,49.99 96.55,48.23 97.54,47.24 97.54,42.67 97.77,42.44 97.77,40.77 96.55,39.55 96.55,36.2 97.16,35.59 R3.2
N$16
  Top 0.152: T4.1 110.34,43.43 114.53,47.62 R10.1
N$17  (via drill 0.38)
  Top 0.152: IC7.7 121.31,41.99 121.31,42.52 122.53,43.74 122.53,45.03 R11.2 122.53,45.11 v122.53,46.18 | 102.26,52.88 102.26,51.05 102.49,50.83 C1.2 | 102.26,52.88 R7.2 | R10.2 122.61,47.62 122.61,50.14 R8.2 122.61,50.22 122.61,51.21 | 122.61,51.21 122.61,52.05 R9.2 | v104.93,52.88 102.26,52.88 | 122.61,51.21 v121.92,51.21
  Bottom 0.152: v104.93,52.88 106.22,52.88 109.8,56.46 116.66,56.46 v121.92,51.21 122.53,50.6 v122.53,46.18
N$18  (via drill 0.38)
  Top 0.152: 100.66,48.01 100.66,50.75 C1.1 | 100.66,48.01 100.66,47.02 C5.1 | 125.01,26.78 125.27,27.05 125.27,37.11 124.28,38.1 120.85,38.1 120.74,37.99 | 125.01,26.78 124.97,26.75 123.9,26.75 123.37,27.28 122,27.28 D2.C | 120.74,37.99 120.02,37.26 120.02,36.8 | 120.74,43.17 120.7,43.13 120.7,38.02 120.74,37.99 | 120.74,43.17 121.23,43.66 121.23,45.03 R11.1 | 120.02,36.8 117.81,36.8 C6.1 | 120.02,36.8 IC7.1 | 125.01,26.78 125.42,26.36 125.42,6.33 123.52,4.42 106.38,4.42 105.46,5.33 105.46,8.84 F1.P$2 | 100.66,48.01 103.63,48.01 105.23,46.41 v106.91,46.41 | v116.2,43.43 116.59,43.05 119.33,43.05 119.63,43.36 120.55,43.36 120.74,43.17
  Bottom 0.152: v106.91,46.41 113.23,46.41 v116.2,43.43
N$19
  Top 0.152: H2.4 5.71,31.7 3.2,29.18 3.2,27.36 D1.A 3.12,27.28 2.59,26.75 2.59,19.05 F2.P$1
N$20  (via drill 0.38)
  Top 0.152: v8.38,42.22 8.38,45.95 R15.1 | v33.53,25.76 v23.09,25.76 | v46.48,25.3 49.07,25.3 51.05,27.28 51.97,27.28 IC2.2
  Bottom 0.152: v8.38,42.22 16.54,34.06 16.61,34.06 21.41,29.26 21.41,27.43 v23.09,25.76 | v33.53,25.76 46.02,25.76 v46.48,25.3
N$21
  Top 0.152: R13.2 112.39,33.07 113.61,33.07 114.53,33.98 H1.1
N$22
  Top 0.152: T8.3 94.94,57.45 94.94,60.05 95.86,60.96 R14.2
N$23
  Top 0.152: S8.1 42.52,18.44 42.52,15.93 R35.1
N$24
  Top 0.152: IC2.5 51.44,31.7 37.19,31.7 34.82,34.06 23.24,34.06 16,41.3 16,42.44 16.23,42.67 16.23,44.96 12.72,48.46 12.72,50.75 R16.1
N$25  (via drill 0.38)
  Top 0.152: v8.31,49 8.31,50.29 R17.1 | v17.45,38.71 17.45,38.1 25.22,30.33 39.78,30.33 40.84,29.26 49.76,29.26 51.05,30.56 53.19,30.56 53.26,30.63 53.26,31.55 52.43,32.38 IC2.6
  Bottom 0.152: v8.31,49 8.31,48.84 17.45,39.7 v17.45,38.71
N$26  (via drill 0.38)
  Top 0.152: IC2.9 v48.31,36.2
  Bottom 0.152: v48.31,36.2 46.79,34.67 46.79,32.46 42.14,27.81 34.82,27.81 22.02,40.62 17.22,40.62 15.01,42.82 15.01,43.28 18.29,46.56 18.29,57.99 R18.1
N$27
  Top 0.152: R19.1 26.44,65.53 26.9,65.99 27.36,65.99 35.81,57.53 35.81,39.93 36.88,38.86 36.88,38.18 38.79,36.27 41.83,36.27 41.91,36.2 IC2.12
N$28  (via drill 0.38)
  Top 0.152: v21.11,51.05 v24.46,47.7 | v15.62,43.05 15.62,44.42 R44.2
  Bottom 0.152: v24.46,47.7 24.46,46.63 T13.3 | v21.11,51.05 21.11,50.83 18.9,48.62 18.9,42.22 17.91,41.22 17.45,41.22 v15.62,43.05
N$29
  Top 0.152: T6.3 10.9,46.41 9.6,46.41 8.99,47.02 7.85,47.02 7.16,46.33 7.16,46.02 R15.2
N$30
  Top 0.152: T7.3 13.18,54.33 13.03,54.33 11.43,52.73 11.43,50.83 R16.2
N$31
  Top 0.152: T9.3 8.38,56.01 7.62,55.24 7.62,54.1 7.77,53.95 7.77,52.96 7.62,52.81 7.62,51.82 7.01,51.21 7.01,50.29 R17.2
N$32  (via drill 0.38)
  Top 0.152: v15.93,58.14 13.11,58.14 T10.3
  Bottom 0.152: v15.93,58.14 16.92,58.14 16.99,58.06 R18.2
N$33
  Top 0.152: T11.3 13.03,63.25 13.03,63.93 11.43,65.53 R19.2
N$34  (via drill 0.38)
  Top 0.152: 43.59,5.11 43.59,4.5 43.05,3.96 41.83,3.96 31.55,14.25 25.76,14.25 K2.16 | 43.59,5.11 43.59,13.41 41.3,15.7 41.3,15.85 R35.2 | 43.59,5.11 v43.81,5.11
  Bottom 0.152: K1.16 84.58,15.24 79.25,9.91 70.03,9.91 61.72,1.6 49.15,1.6 45.64,5.11 v43.81,5.11
N$35
  Top 0.152: T6.1 11.89,48.39 11.89,46.1 10.21,44.42 10.21,39.4 R22.1
N$36
  Top 0.152: R23.1 9.75,48.01 12.04,50.29 12.04,51.28 12.19,51.44 12.19,52.27 T7.1
N$37
  Top 0.152: T9.1 6.33,57.38 6.33,52.96 6.93,52.35 R24.1
N$38
  Top 0.152: T10.1 12.04,56.08 9.6,56.08 8.31,54.79 R25.1
N$39  (via drill 0.38)
  Top 0.152: v7.16,53.72 7.01,53.87 7.01,54.71 R25.2 | v8.38,53.34 8.38,52.43 8.31,52.35 R24.2 8.23,52.27 8.23,51.97 7.62,51.36 7.62,49.76 6.86,49 6.86,48.01 R23.2 6.78,48.01 6.78,46.79 6.48,46.48 6.48,45.41 6.63,45.26 7.54,45.26 7.77,45.49 7.77,46.48 8,46.71 8.84,46.71 8.99,46.56 8.99,39.32 R22.2 8.91,39.32 8.91,37.87 10.4,36.39 | 10.4,36.39 10.97,35.81 12.65,35.81 13.64,36.8 C2.2 13.72,36.88 13.95,37.11 13.95,39.32 R26.2 | 10.4,36.39 9.45,35.43 6.55,35.43 6.4,35.59 6.4,37.87 4.5,39.78 4.5,41.91 IC8.7
  Bottom 0.152: v7.16,53.72 8,53.72 v8.38,53.34
N$40  (via drill 0.38)
  Top 0.152: C2.1 11.81,36.88 12.65,37.72 12.65,39.32 R26.1 12.72,39.4 12.88,39.4 13.56,40.08 14.4,40.08 14.63,39.85 14.63,36.04 13.41,34.82 9.37,34.82 9.11,34.56 | 9.11,28.92 9.14,28.96 9.14,34.52 9.11,34.56 | 9.11,28.92 7.54,27.36 5.71,27.36 D1.C 5.64,27.28 4.42,26.06 4.42,19.2 2.59,17.37 2.59,8.91 F2.P$2 | 9.11,34.56 8.53,35.13 4.34,35.13 3.2,36.27 3.2,36.73 IC8.1 | 9.11,28.92 9.3,28.73 13.95,28.73 14.17,28.96 33.6,28.96 35.2,27.36 35.2,22.86 C8.1 35.28,22.86 37.72,20.42 37.72,17.68 38.41,16.99 v41.45,16.99 | v57.99,15.01 62.18,10.82 67.59,10.82 C7.1 | v48.54,14.63 v50.83,14.63
  Bottom 0.152: v57.99,15.01 52.58,15.01 52.2,14.63 v50.83,14.63 | v48.54,14.63 43.81,14.63 v41.45,16.99
N$41
  Bottom 0.152: T12.1 23.55,52.5 23.55,53.42 24.08,53.95 R37.1
N$42  (via drill 0.38)
  Top 0.152: v61.11,16.08 62.56,14.63 71.86,14.63 73.08,15.85 R21.2 | v26.44,29.57 13.18,29.57 13.11,29.49 H2.1
  Bottom 0.152: v61.11,16.08 61.11,15.7 53.57,8.15 53.57,7.01 52.96,6.4 49.68,6.4 43.59,12.5 43.59,14.02 40.23,17.37 40.23,20.04 36.5,23.77 34.14,23.77 32.16,25.76 30.25,25.76 v26.44,29.57
N$43
  Top 0.152: T15.1 11.89,43.05 11.89,43.97 11.43,44.42 R38.1
N$44  (via drill 0.38)
  Top 0.152: T14.1 20.04,43.43 20.5,42.98 21.49,42.98 v22.33,43.81
  Bottom 0.152: v22.33,43.81 22.33,44.04 22.94,44.65 R39.1
N$45
  Top 0.152: IC7.4 123.83,36.27 122.99,35.43 115.52,35.43 113.92,37.03 113.08,37.03 T5.1
N$46
  Bottom 0.152: T13.1 23.55,48.62 23.55,45.26 23.62,45.19 23.62,42.82 23.01,42.22 R40.1
N$47  (via drill 0.38)
  Top 0.152: v12.04,59.51 12.04,61.19 T11.1 | v6.78,38.41 6.78,36.96 6.93,36.8 IC8.4
  Bottom 0.152: v12.04,59.51 5.56,53.03 5.56,50.37 4.5,49.3 2.67,49.3 1.75,48.39 1.75,43.43 v6.78,38.41
N$48
  Top 0.152: T14.3 19.13,43.66 19.13,41.91 R43.2
N$49  (via drill 0.38)
  Top 0.152: v25.53,49 25.53,41.38 24.16,40.01 R41.2
  Bottom 0.152: v25.53,49 24.54,49.99 24.54,50.37 T12.3
N$50
  Top 0.152: T15.3 10.97,41 11.73,41 12.42,40.31 13.34,40.31 13.64,40.62 14.02,40.62 15.32,41.91 R42.2
RHVTRIG
  Top 0.152: R21.1 74.3,22.33 69.49,27.13 67.36,27.13 IC5.3
RTS+  (via drill 0.38)
  Top 0.152: v22.71,26.98 23.85,26.98 24.77,27.89 K2.O2
  Bottom 0.152: X5.1 38.1,3.05 28.27,12.88 28.27,22.02 23.7,26.59 23.09,26.59 v22.71,26.98
RTS-
  Top 0.152: X5.2 42.6,5.41 42.6,9.98 34.14,18.44 34.14,26.14 32.38,27.89 K2.O1
RVSEL
  Top 0.152: IC5.25 59.59,34.37 55.09,34.37 53.8,35.66 53.19,35.66 53.11,35.59 46.02,35.59 45.03,36.58 43.28,36.58 42.44,37.41 41.99,37.41 IC2.11
SCL  (via drill 0.38)
  Top 0.152: v69.04,33.76 67.36,33.76 IC5.13 | v77.72,29.87 79.7,27.89 81.84,27.89 84.96,24.77 84.96,19.89 83.29,18.21 83.13,18.21 80.47,15.54 80.47,14.48 76.73,10.74 76.73,9.37 X2.2 76.66,9.3 76.66,8 76.2,7.54 v76.2,7.24 | v66.29,2.13 54.18,2.13 54.03,2.29 54.03,4.04 52.96,5.11 50.52,5.11 48.16,7.47 48.16,9.3 X4.2
  Bottom 0.152: v69.04,33.76 69.57,34.29 70.1,34.29 74.52,29.87 v77.72,29.87 | v66.29,2.13 66.67,2.13 70.94,6.4 75.36,6.4 v76.2,7.24
SDA  (via drill 0.38)
  Top 0.152: v87.25,22.94 87.25,23.7 81.76,29.18 79.63,29.18 79.4,29.41 79.4,30.02 76.35,33.07 67.36,33.07 IC5.12 | v85.57,21.26 85.57,19.96 84.58,18.97 84.58,15.24 80.54,11.2 77.95,11.2 77.5,10.74 77.5,9.37 X2.3 77.42,9.3 77.42,7.62 75.59,5.79 71.93,5.79 71.32,5.18 54.25,5.18 54.03,5.41 50.67,5.41 48.92,7.16 48.92,9.3 X4.3
  Bottom 0.152: v85.57,21.26 v87.25,22.94
SPKR  (via drill 0.38)
  Top 0.152: v94.34,58.37 94.56,58.6 94.56,60.96 R14.1 | v94.49,47.7 94.49,45.87 95.48,44.88 95.48,43.97 93.34,41.83 93.34,39.62 92.05,38.33 92.05,37.03 91.82,36.8 89.69,36.8 89.31,36.42 v89.31,35.59 | v72.77,32.46 67.36,32.46 IC5.11
  Bottom 0.152: v94.34,58.37 94.34,47.85 v94.49,47.7 | v89.31,35.59 89.31,33.22 87.17,31.09 74.14,31.09 v72.77,32.46
TCK  (via drill 0.38)
  Top 0.152: IC5.35 59.59,27.81 59.21,27.81 57.45,26.06 57.45,21.34 56.54,20.42 56.54,19.74 R32.1 56.62,19.74 v57.38,18.97 | 70.37,11.7 67.74,14.33 62.03,14.33 v58.75,17.6 | 70.37,11.7 70.41,11.66 70.41,6.1 70.26,5.94 68.81,5.94 67.82,6.93 67.67,6.93 C18.1 | v32.08,26.36 v17.98,26.36 | v52.2,19.96 v50.22,19.96 | v97.61,28.04 92.13,22.55 v92.13,18.59 | 70.37,11.7 v70.56,11.89
  Bottom 0.152: v58.75,17.6 v57.38,18.97 56.39,19.96 v52.2,19.96 | v17.98,26.36 1.45,42.9 1.45,57.84 1.98,58.37 3.81,58.37 SV1.3 | v32.08,26.36 34.37,24.08 40.62,24.08 44.73,19.96 v50.22,19.96 | S5.2 109.58,38.18 99.44,28.04 v97.61,28.04 | v92.13,18.59 77.27,18.59 v70.56,11.89
TDI  (via drill 0.38)
  Top 0.152: R34.1 6.4,60.96 6.4,58.83 4.5,56.92 2.67,56.92 2.06,56.31 2.06,55.09 SV1.5 3.66,53.42 1.75,51.51 v1.75,41.76 | v58.06,25.45 59.13,26.52 59.59,26.52 IC5.37 | v54.03,21.79 52.96,21.79 51.82,22.94 S7.2 | v99.67,29.87 106.22,29.87 107.29,28.8 107.29,27.13 107.52,26.9 112.17,26.9 113.16,27.89 113.31,27.89 C20.1 | v97.61,31.93 91.97,31.93 91.75,31.7 v88.62,31.7 | v29.64,23.85 v19.66,23.85 | v38.63,17.6 39.78,17.6 41.07,18.9 41.07,20.04 41.6,20.57 v47.4,20.57
  Bottom 0.152: v54.03,21.79 57.68,25.45 v58.06,25.45 62.26,25.45 64.62,27.81 66.52,27.81 67.44,26.9 75.59,26.9 79.02,30.33 86.87,30.33 88.24,31.7 v88.62,31.7 | v97.61,31.93 v99.67,29.87 | v19.66,23.85 v1.75,41.76 | v29.64,23.85 29.64,23.39 35.43,17.6 v38.63,17.6 | v47.4,20.57 49.38,20.57 51.74,22.94 S7.2
TDO  (via drill 0.38)
  Top 0.152: v90.14,23.77 90.22,23.7 90.22,22.33 89.53,21.64 R36.1 | v95.78,24.16 100.89,29.26 105,29.26 106.3,27.96 C21.1 | 72.54,20.04 73.61,20.04 v73.69,20.12 | 72.54,20.04 64.16,20.04 59.66,24.54 59.66,25.83 IC5.38 | v36.88,16.54 36.88,19.05 S8.3 | 72.54,20.04 v72.54,18.59 | v9.3,36.12 7.77,37.64 7.77,43.59 6.17,45.19 6.17,48.54 3.96,50.75 3.81,50.75 SV1.6 | v32.61,24.46 v20.95,24.46
  Bottom 0.152: v95.78,24.16 93.73,24.16 93.34,23.77 v90.14,23.77 87.17,23.77 83.52,20.12 v73.69,20.12 | v36.88,16.54 43.51,9.91 45.72,9.91 50.22,5.41 56.16,5.41 58.14,3.43 58.6,3.43 62.41,7.24 62.41,14.1 66.9,18.59 v72.54,18.59 | v20.95,24.46 v9.3,36.12 | v32.61,24.46 32.99,24.46 36.8,20.65 36.8,19.05 S8.3
TEST  (via drill 0.38)
  Top 0.152: v85.95,19.51 89.53,15.93 R20.1 | v69.04,24.16 67.36,25.83 IC5.1 | v78.72,39.62 78.41,39.93 36.58,39.93 36.12,40.39 36.12,57.68 27.51,66.29 8.38,66.29 5.64,63.55 3.81,63.55 SV1.1
  Bottom 0.152: v85.95,19.51 72.69,19.51 72.43,19.77 | 72.43,19.77 69.04,23.16 v69.04,24.16 | v78.72,39.62 86.11,39.62 89.92,35.81 89.92,27.13 83.52,20.73 73.38,20.73 72.43,19.77
TMS  (via drill 0.38)
  Top 0.152: v60.43,24.61 60.43,26.82 60.12,27.13 59.66,27.13 IC5.36 | v59.21,16.23 59.21,15.54 v63.32,11.43 | v63.32,4.04 66.75,4.04 67.59,3.2 C19.1 67.67,3.12 v67.67,1.52 | v2.06,57.61 2.06,61.42 2.59,61.95 4.5,61.95 6.02,63.48 6.71,63.48 R33.1 | v5.64,44.88 5.64,48.62 4.5,49.76 2.67,49.76 2.06,50.37 2.06,51.28 3.12,52.35 5.03,52.35 5.56,52.88 5.56,54.1 3.81,55.85 SV1.4
  Bottom 0.152: v60.43,24.61 60.43,17.45 v59.21,16.23 | v63.32,4.04 v63.32,11.43 | v2.06,57.61 3.81,55.85 SV1.4 | v5.64,44.88 6.55,44.88 14.4,37.03 16.61,37.03 18.36,38.79 20.65,38.79 S6.2 20.73,38.79 21.72,37.8 21.72,28.8 23.62,26.9 23.85,26.9 28.57,22.17 28.57,16.84 31.17,14.25 31.55,14.25 36.35,9.45 36.35,9.14 44.65,0.84 66.6,0.84 67.28,1.52 v67.67,1.52
VBAT  (via drill 0.38)
  Top 0.152: v95.86,43.51 R45.1 | v103.1,44.81 102.56,44.81 102.26,44.5 R46.2 | v58.6,32.46 59.59,32.46 IC5.28 | v72.77,34.9 74.75,36.88 86.79,36.88 v88.77,38.86 | v93.42,38.86 93.42,39.24 95.86,41.68 R45.1 | R45.1
  Bottom 0.152: v95.86,43.51 95.86,43.81 95.63,44.04 95.63,44.81 96.16,45.34 97.54,45.34 98.07,44.81 v103.1,44.81 | v58.6,32.46 65.61,32.46 68.05,34.9 v72.77,34.9 | v93.42,38.86 v88.77,38.86
VCC  (via drill 0.38)
  Top 0.305: IC3.3 117.27,44.12 119.02,44.12 121.77,46.86 123.06,46.86 123.29,47.09 123.29,53.95 121.69,55.55 121.69,58.14 118.87,60.96 SG1.+ 118.72,61.04 117.35,62.41 111.78,62.41 111.63,62.26 108.05,62.26 L3.1 107.9,62.18 104.24,65.84 96.7,65.84 95.63,64.77 C10.1 95.48,64.69 v92.73,61.95 | v47.4,7.24 47.32,7.32 47.32,9.3 X4.1 47.4,9.45 47.4,10.9 47.78,11.28 51.66,11.28 53.65,9.3 53.65,6.4 54.48,5.56 70.48,5.56 71.09,6.17 74.14,6.17 75.82,7.85 75.82,9.3 X2.1 75.97,9.45 75.97,10.9 80.09,15.01 80.09,15.85 v84.35,20.12
  Bottom 0.305: 97.38,23.32 96.47,24.23 96.47,31.17 K1.S2 94.56,33.15 94.56,38.71 92.2,41.07 92.2,48.08 92.73,48.62 v92.73,61.95 | 97.38,23.32 102.18,18.52 102.18,15.24 K1.1 | K2.S2 24.77,30.25 28.96,26.06 28.96,18.67 K2.1 32.46,15.16 35.36,15.16 44.2,6.33 45.72,6.33 46.63,7.24 v47.4,7.24 | 97.38,23.32 94.26,20.19 84.43,20.19 v84.35,20.12
XIN
  Top 0.152: IC5.6 67.36,29.18 72.77,29.18 73.61,30.02 Q3.2 73.69,30.1 73.91,30.33 73.91,31.7 C12.1
XOUT
  Top 0.152: IC5.5 67.36,28.5 73.53,28.5 73.61,28.42 Q3.1 73.69,28.35 74.98,27.05 76.2,27.05 C11.1